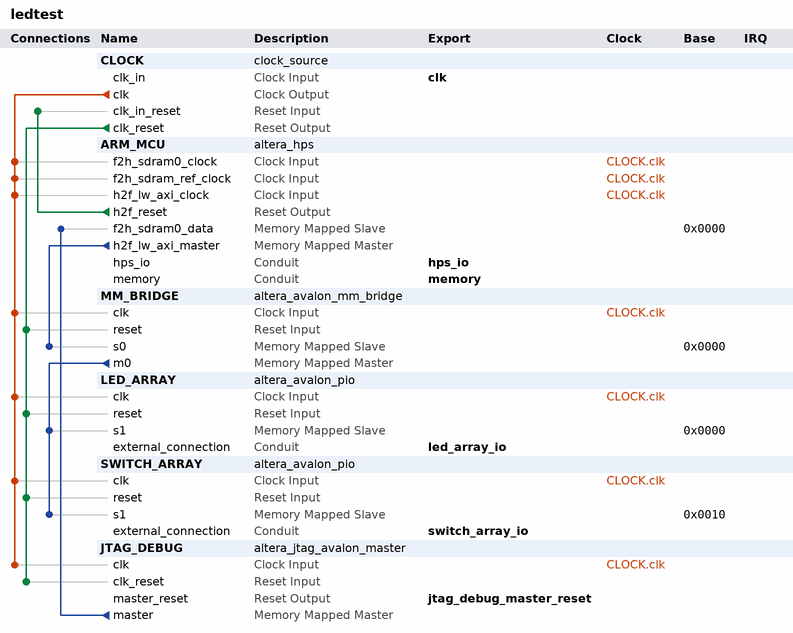
[diagram p0: system contents]
# Platform Designer (Qsys) system ledtest, Cyclone V 5CSEBA6U23I7
# Parameters at their usual value, and those the tool derives, are not listed.
package require -exact qsys 17.0
create_system ledtest
set_project_property DEVICE_FAMILY {Cyclone V}
set_project_property DEVICE 5CSEBA6U23I7

add_instance CLOCK clock_source 17.0
set_instance_parameter_value CLOCK clockFrequency 50000000

add_instance ARM_MCU altera_hps 17.0
set_instance_parameter_value ARM_MCU EMAC1_Mode RGMII
set_instance_parameter_value ARM_MCU EMAC1_PinMuxing {HPS I/O Set 0}
set_instance_parameter_value ARM_MCU F2SCLK_COLDRST_Enable false
set_instance_parameter_value ARM_MCU F2SCLK_DBGRST_Enable false
set_instance_parameter_value ARM_MCU F2SCLK_SDRAMCLK_Enable true
set_instance_parameter_value ARM_MCU F2SCLK_WARMRST_Enable false
set_instance_parameter_value ARM_MCU F2SDRAM_Type {Avalon-MM Bidirectional}
set_instance_parameter_value ARM_MCU F2SDRAM_Width 256
set_instance_parameter_value ARM_MCU F2SINTERRUPT_Enable false
set_instance_parameter_value ARM_MCU F2S_Width 0
set_instance_parameter_value ARM_MCU FPGA_PERIPHERAL_OUTPUT_CLOCK_FREQ_EMAC0_GTX_CLK 125
set_instance_parameter_value ARM_MCU FPGA_PERIPHERAL_OUTPUT_CLOCK_FREQ_EMAC0_MD_CLK 2.5
set_instance_parameter_value ARM_MCU FPGA_PERIPHERAL_OUTPUT_CLOCK_FREQ_EMAC1_GTX_CLK 125
set_instance_parameter_value ARM_MCU FPGA_PERIPHERAL_OUTPUT_CLOCK_FREQ_EMAC1_MD_CLK 2.5
set_instance_parameter_value ARM_MCU HPS_PROTOCOL DDR3
set_instance_parameter_value ARM_MCU I2C0_Mode N/A
set_instance_parameter_value ARM_MCU I2C0_PinMuxing Unused
set_instance_parameter_value ARM_MCU I2C1_Mode N/A
set_instance_parameter_value ARM_MCU I2C1_PinMuxing Unused
set_instance_parameter_value ARM_MCU LWH2F_Enable true
set_instance_parameter_value ARM_MCU MEM_BANKADDR_WIDTH 3
set_instance_parameter_value ARM_MCU MEM_CLK_FREQ 400.0
set_instance_parameter_value ARM_MCU MEM_COL_ADDR_WIDTH 10
set_instance_parameter_value ARM_MCU MEM_DQ_WIDTH 32
set_instance_parameter_value ARM_MCU MEM_DRV_STR RZQ/6
set_instance_parameter_value ARM_MCU MEM_ROW_ADDR_WIDTH 15
set_instance_parameter_value ARM_MCU MEM_RTT_NOM RZQ/6
set_instance_parameter_value ARM_MCU MEM_RTT_WR {Dynamic ODT off}
set_instance_parameter_value ARM_MCU MEM_TCL 7
set_instance_parameter_value ARM_MCU MEM_TFAW_NS 37.5
set_instance_parameter_value ARM_MCU MEM_TINIT_US 499
set_instance_parameter_value ARM_MCU MEM_TMRD_CK 3
set_instance_parameter_value ARM_MCU MEM_TRAS_NS 40.0
set_instance_parameter_value ARM_MCU MEM_TRCD_NS 15.0
set_instance_parameter_value ARM_MCU MEM_TREFI_US 7.0
set_instance_parameter_value ARM_MCU MEM_TRFC_NS 75.0
set_instance_parameter_value ARM_MCU MEM_TRP_NS 15.0
set_instance_parameter_value ARM_MCU MEM_TWTR 2
set_instance_parameter_value ARM_MCU MEM_VENDOR Other
set_instance_parameter_value ARM_MCU MEM_WTCL 7
set_instance_parameter_value ARM_MCU QSPI_Mode N/A
set_instance_parameter_value ARM_MCU QSPI_PinMuxing Unused
set_instance_parameter_value ARM_MCU REF_CLK_FREQ 25.0
set_instance_parameter_value ARM_MCU S2FCLK_USER2CLK 5
set_instance_parameter_value ARM_MCU S2F_Width 0
set_instance_parameter_value ARM_MCU SDIO_Mode N/A
set_instance_parameter_value ARM_MCU SDIO_PinMuxing Unused
set_instance_parameter_value ARM_MCU SPIM1_Mode N/A
set_instance_parameter_value ARM_MCU SPIM1_PinMuxing Unused
set_instance_parameter_value ARM_MCU STM_Enable false
set_instance_parameter_value ARM_MCU TIMING_BOARD_AC_SKEW 0.02
set_instance_parameter_value ARM_MCU TIMING_BOARD_AC_TO_CK_SKEW 0.0
set_instance_parameter_value ARM_MCU TIMING_BOARD_DQ_TO_DQS_SKEW 0.0
set_instance_parameter_value ARM_MCU TIMING_BOARD_MAX_CK_DELAY 0.6
set_instance_parameter_value ARM_MCU TIMING_BOARD_MAX_DQS_DELAY 0.6
set_instance_parameter_value ARM_MCU TIMING_BOARD_SKEW_BETWEEN_DQS 0.02
set_instance_parameter_value ARM_MCU TIMING_BOARD_SKEW_CKDQS_DIMM_MAX 0.01
set_instance_parameter_value ARM_MCU TIMING_BOARD_SKEW_CKDQS_DIMM_MIN -0.01
set_instance_parameter_value ARM_MCU TIMING_BOARD_SKEW_WITHIN_DQS 0.02
set_instance_parameter_value ARM_MCU TIMING_TDH 125
set_instance_parameter_value ARM_MCU TIMING_TDQSCK 400
set_instance_parameter_value ARM_MCU TIMING_TDQSQ 120
set_instance_parameter_value ARM_MCU TIMING_TDS 50
set_instance_parameter_value ARM_MCU TIMING_TIH 250
set_instance_parameter_value ARM_MCU TIMING_TIS 175
set_instance_parameter_value ARM_MCU TIMING_TQSH 0.38
set_instance_parameter_value ARM_MCU UART0_Mode N/A
set_instance_parameter_value ARM_MCU UART0_PinMuxing Unused
set_instance_parameter_value ARM_MCU USB1_Mode N/A
set_instance_parameter_value ARM_MCU USB1_PinMuxing Unused
set_instance_parameter_value ARM_MCU desired_cfg_clk_mhz 100.0
set_instance_parameter_value ARM_MCU desired_qspi_clk_mhz 400.0

add_instance MM_BRIDGE altera_avalon_mm_bridge 17.0
set_instance_parameter_value MM_BRIDGE ADDRESS_UNITS SYMBOLS
set_instance_parameter_value MM_BRIDGE ADDRESS_WIDTH 10
set_instance_parameter_value MM_BRIDGE DATA_WIDTH 32
set_instance_parameter_value MM_BRIDGE MAX_PENDING_RESPONSES 4
set_instance_parameter_value MM_BRIDGE USE_AUTO_ADDRESS_WIDTH 1

add_instance LED_ARRAY altera_avalon_pio 17.0
set_instance_parameter_value LED_ARRAY direction Output
set_instance_parameter_value LED_ARRAY width 8

add_instance SWITCH_ARRAY altera_avalon_pio 17.0
set_instance_parameter_value SWITCH_ARRAY direction Input
set_instance_parameter_value SWITCH_ARRAY width 4

add_instance JTAG_DEBUG altera_jtag_avalon_master 17.0

# connections
add_connection CLOCK.clk ARM_MCU.f2h_sdram0_clock clock
add_connection CLOCK.clk ARM_MCU.f2h_sdram_ref_clock clock
add_connection CLOCK.clk ARM_MCU.h2f_lw_axi_clock clock
add_connection CLOCK.clk JTAG_DEBUG.clk clock
add_connection CLOCK.clk LED_ARRAY.clk clock
add_connection CLOCK.clk MM_BRIDGE.clk clock
add_connection CLOCK.clk SWITCH_ARRAY.clk clock
add_connection ARM_MCU.h2f_reset CLOCK.clk_in_reset reset
add_connection CLOCK.clk_reset JTAG_DEBUG.clk_reset reset
add_connection CLOCK.clk_reset LED_ARRAY.reset reset
add_connection CLOCK.clk_reset MM_BRIDGE.reset reset
add_connection CLOCK.clk_reset SWITCH_ARRAY.reset reset
add_connection ARM_MCU.h2f_lw_axi_master MM_BRIDGE.s0 avalon
set_connection_parameter_value ARM_MCU.h2f_lw_axi_master/MM_BRIDGE.s0 baseAddress 0x0000
add_connection JTAG_DEBUG.master ARM_MCU.f2h_sdram0_data avalon
set_connection_parameter_value JTAG_DEBUG.master/ARM_MCU.f2h_sdram0_data baseAddress 0x0000
add_connection MM_BRIDGE.m0 LED_ARRAY.s1 avalon
set_connection_parameter_value MM_BRIDGE.m0/LED_ARRAY.s1 baseAddress 0x0000
add_connection MM_BRIDGE.m0 SWITCH_ARRAY.s1 avalon
set_connection_parameter_value MM_BRIDGE.m0/SWITCH_ARRAY.s1 baseAddress 0x0010

# exported interfaces
add_interface clk clock sink
set_interface_property clk EXPORT_OF CLOCK.clk_in
add_interface hps_io conduit end
set_interface_property hps_io EXPORT_OF ARM_MCU.hps_io
add_interface jtag_debug_master_reset reset source
set_interface_property jtag_debug_master_reset EXPORT_OF JTAG_DEBUG.master_reset
add_interface led_array_io conduit end
set_interface_property led_array_io EXPORT_OF LED_ARRAY.external_connection
add_interface memory conduit end
set_interface_property memory EXPORT_OF ARM_MCU.memory
add_interface switch_array_io conduit end
set_interface_property switch_array_io EXPORT_OF SWITCH_ARRAY.external_connection

set_interconnect_requirement {$system} qsys_mm.clockCrossingAdapter HANDSHAKE
set_interconnect_requirement {$system} qsys_mm.enableEccProtection FALSE
set_interconnect_requirement {$system} qsys_mm.insertDefaultSlave FALSE
set_interconnect_requirement {$system} qsys_mm.maxAdditionalLatency 1

save_system ledtest.qsys
